# EAGLE design ps_3PS (EAGLE 7.2.0)
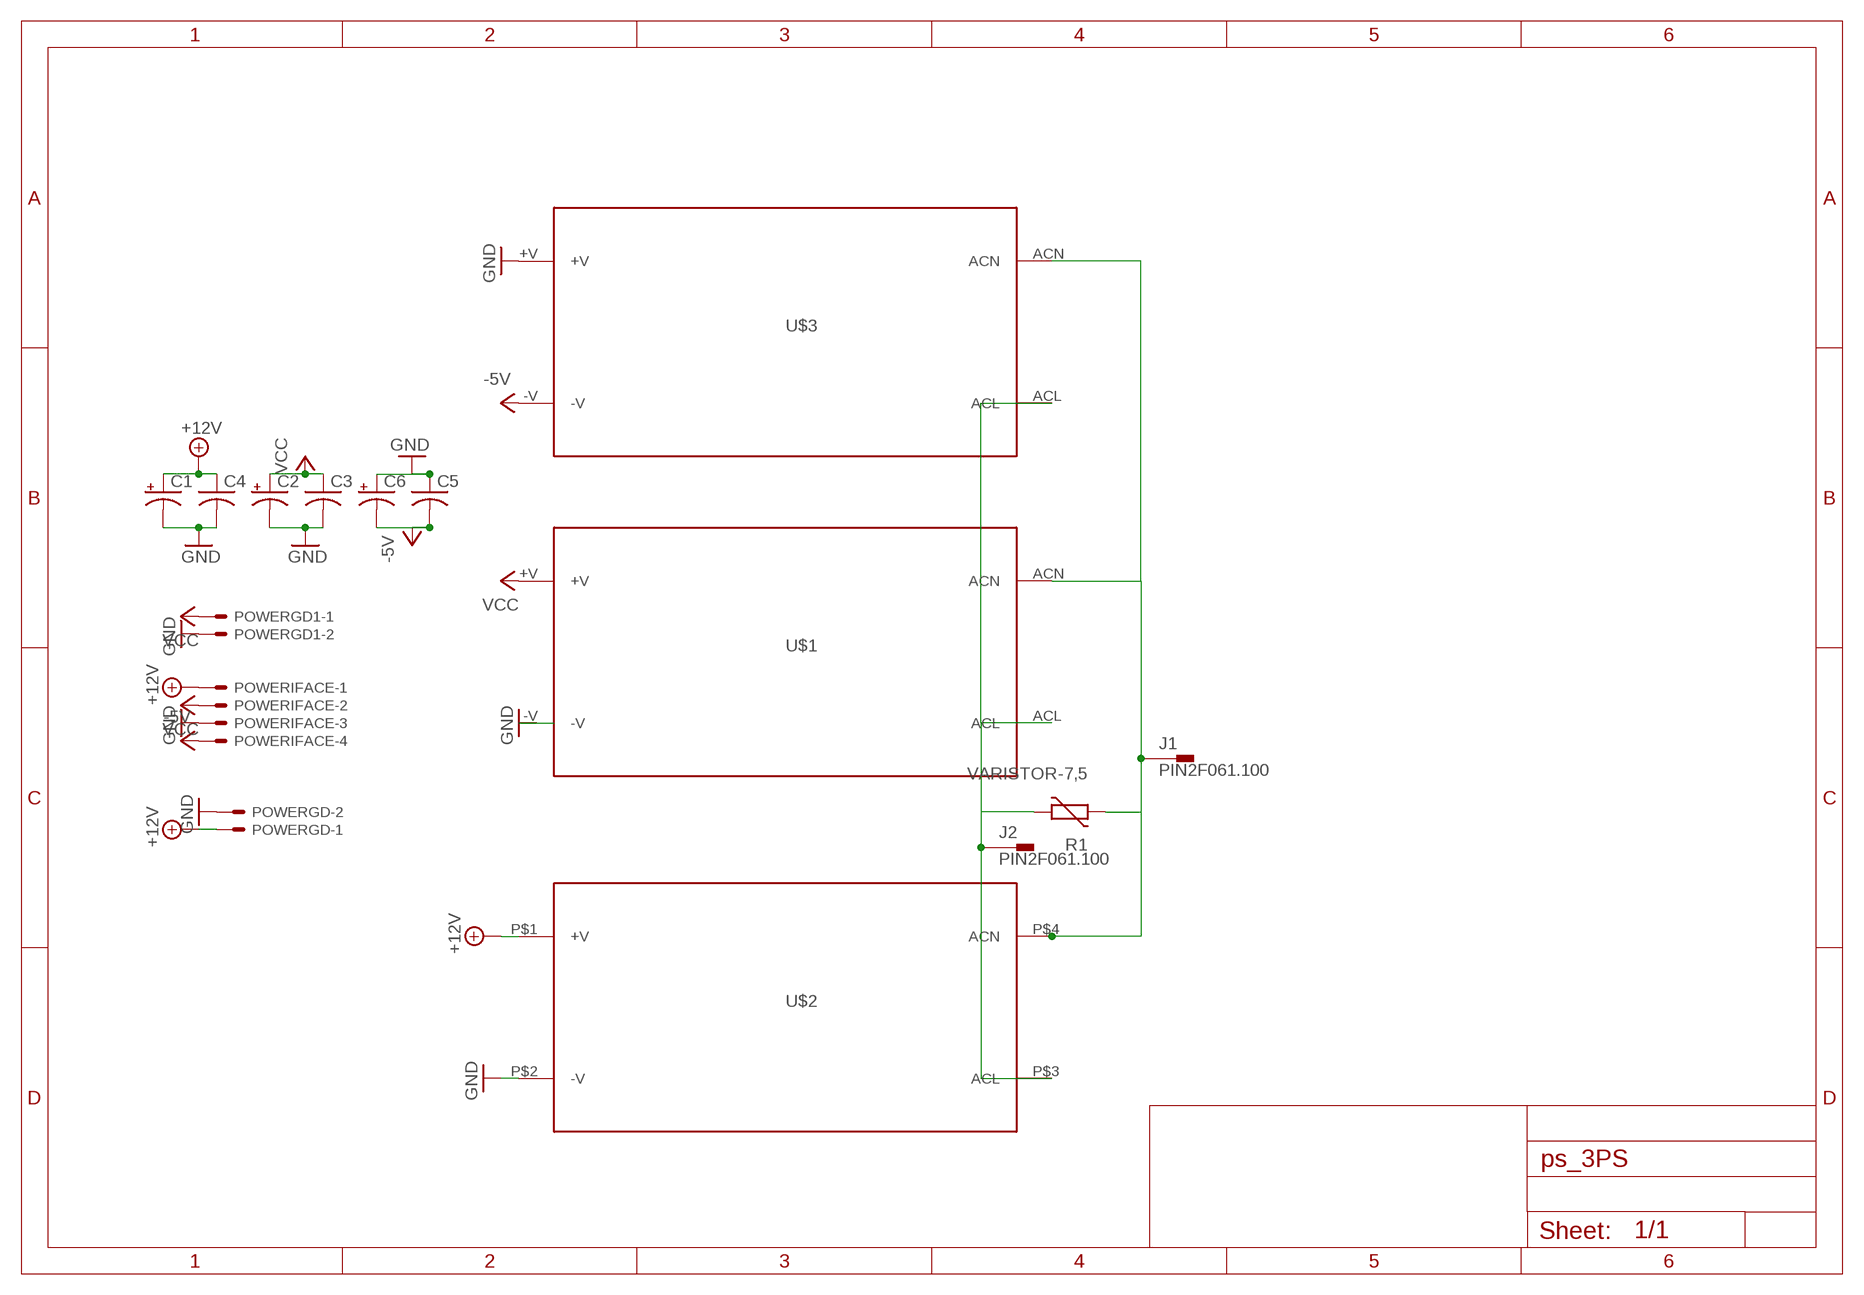
[diagram p0: schematic, sheet 1]

## Parts
C1  CPOL-USE5-13  [E5-13]
C2  CPOL-USE5-13  [E5-13]
C3  C-US050-050X075  [C050-050X075]
C4  C-US050-050X075  [C050-050X075]
C5  C-US050-050X075  [C050-050X075]
C6  CPOL-USE5-13  [E5-13]
J1  PIN2F061.100  [F061.100]
J2  PIN2F061.100  [F061.100]
POWERGD  KK-156-2  [KK-156-2]
POWERGD1  KK-156-2  [KK-156-2]
POWERIFACE  KK-156-4  [KK-156-4]
R1  VARISTOR-7,5  [R-7,5]
U$1  IRM-05-05  [IRM-05-05]
U$2  IRM-60-12  [IRM-60-12]
U$3  IRM-05-05  [IRM-05-05]

## Nets
+12V: C1.+ C4.1 POWERGD.1 POWERIFACE.1 U$2.P$1(+V)
-5V: C5.2 C6.- POWERIFACE.4 U$3.-V
GND: C1.- C2.- C3.2 C4.2 C5.1 C6.+ POWERGD1.2 POWERGD.2 POWERIFACE.3 U$1.-V U$2.P$2(-V) U$3.+V
N$1: J1.A1 J1.A2 R1.2 U$1.ACN U$2.P$4(ACN) U$3.ACN
N$2: J2.A1 J2.A2 R1.1 U$1.ACL U$2.P$3(ACL) U$3.ACL
VCC: C2.+ C3.1 POWERGD1.1 POWERIFACE.2 U$1.+V

## Library data of the parts
C1 C2 C6 = rcl:CPOL-US: POLARIZED CAPACITOR, American symbol
C3-C5 = rcl:C-US: CAPACITOR, American symbol
J1 J2 = con-faston:PIN2: Flachstecker Typ Tyco/Electronics/AMP TAB, FASTON Printed Circuit Board Tabs Source: http://www.buerklin.com, http://catalog.tycoelectronics.com; OC_FARNELL: unknown; OC_NEWARK: unknown
POWERGD POWERGD1 = con-molex:KK-156-2: KK 156 HEADER Source: http://www.molex.com/pdm_docs/sd/026604100_sd.pdf; OC_FARNELL: unknown; OC_NEWARK: unknown
POWERIFACE = con-molex:KK-156-4: KK 156 HEADER Source: http://www.molex.com/pdm_docs/sd/026604100_sd.pdf; OC_FARNELL: unknown; OC_NEWARK: unknown
R1 = varistor:VARISTOR: VARISTOR
U$1 U$3 = meanwell:IRM-05-05
U$2 = meanwell:IRM-60-12

## Board
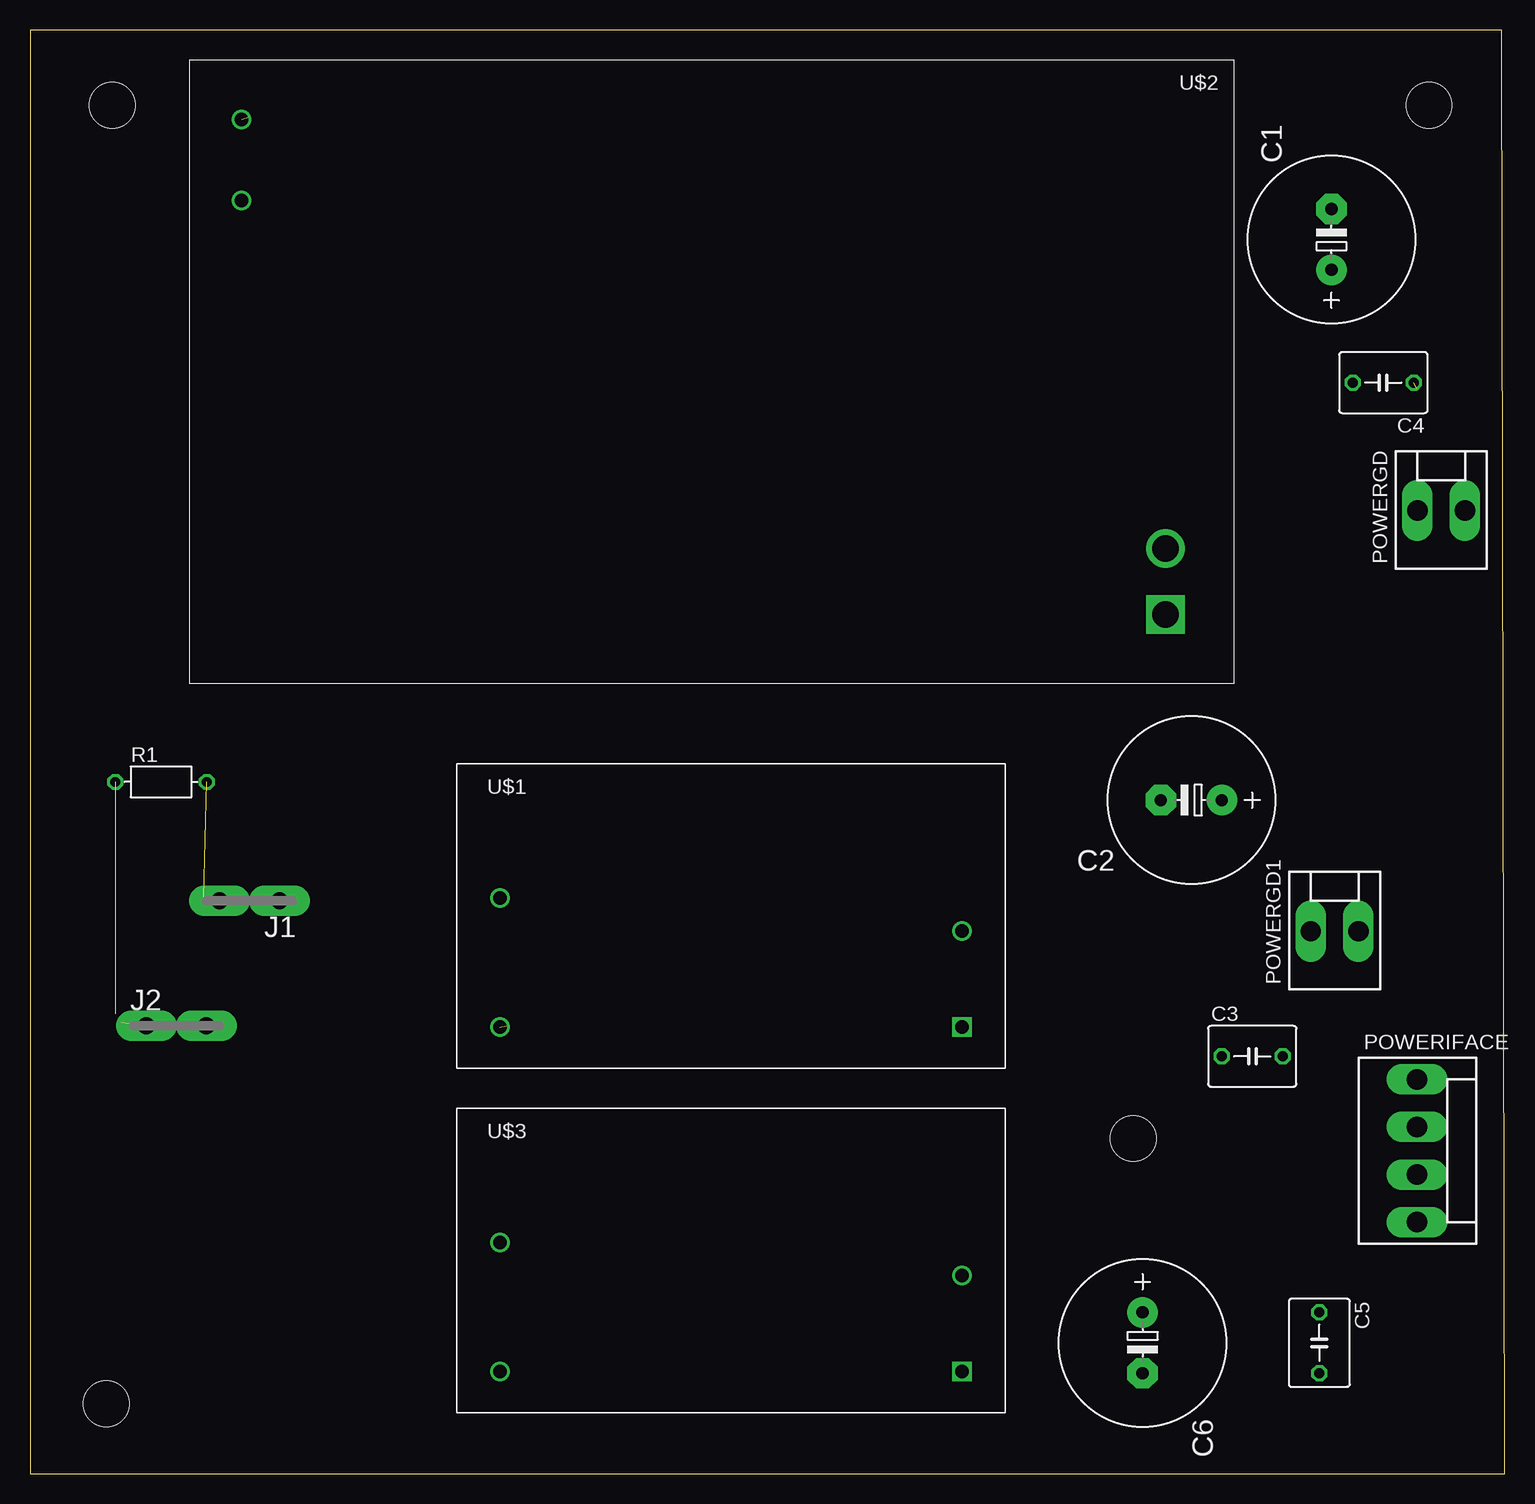
[diagram p1: board, top side]
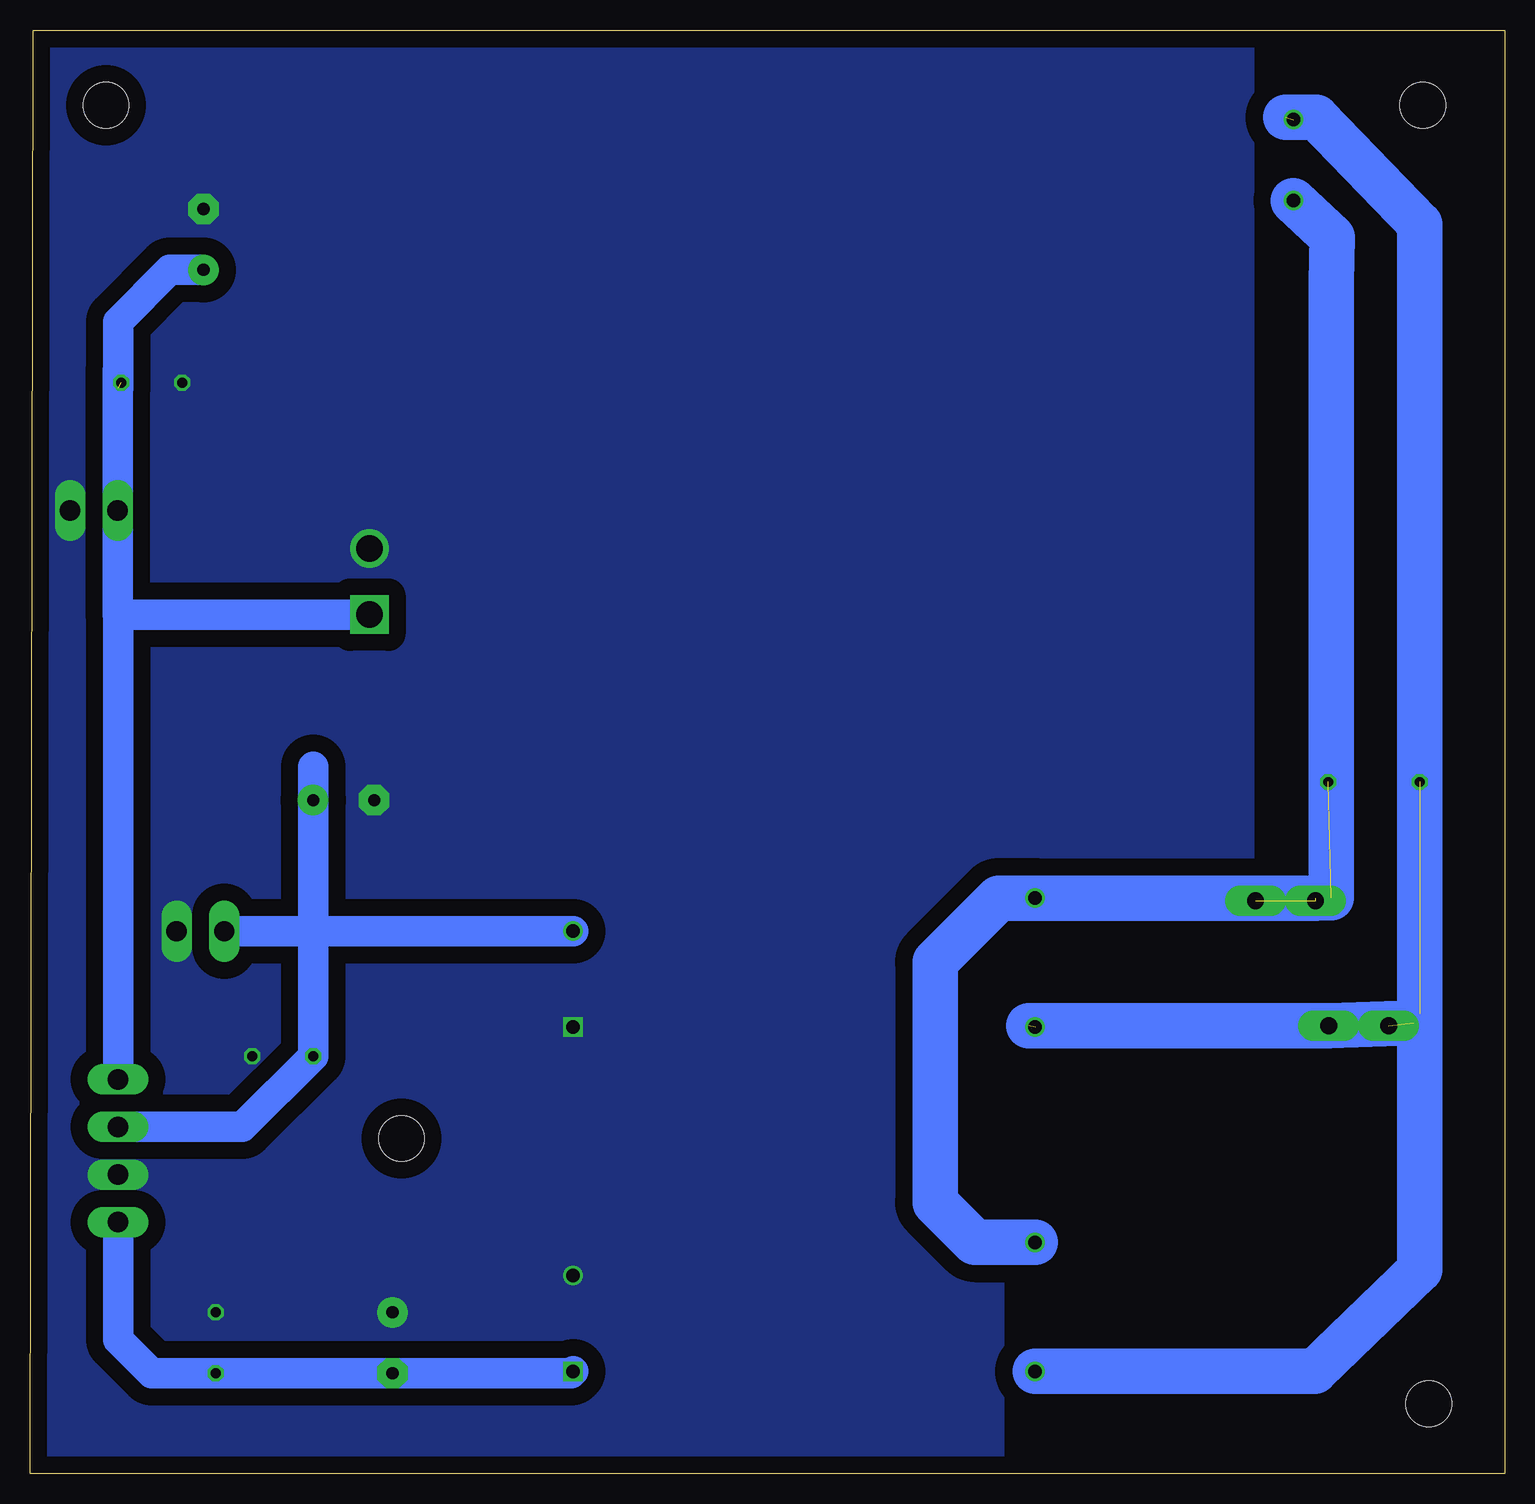
[diagram p2: board, bottom side, seen from below]

Size 122.92 x 120.32 mm. Coordinates in mm from the lower left corner, seen from the top.
Outline: 0,0 122.92,0 122.66,120.32 0,120.32 0,0
Copper layers (1*16): Top 0.035mm / dielectric 1.5mm / Bottom 0.035mm
Design rules "default": minimum track width 10mil, minimum drill 24mil, track to track 8mil, track to pad 8mil, pad to pad 8mil, via to via 8mil, smd to smd 8mil, copper to edge 40mil, drill to drill 8mil, minimum pad ring 10mil, minimum via ring 8mil, stop-mask expansion 4mil, vias tented up to drill 0mil, thermal gap 10mil
Holes 3.8 mm at 116.59,114.05 91.95,27.94 6.86,114.05 6.35,5.84

### Footprints (pad centres in the part's own frame; a part is rotated, then mirrored left to right if it is on the bottom)
E5-13 = drill 1.016 pad 2.54: + -2.54,0 | drill 1.016 pad 2.54 octagon: - 2.54,0
C050-050X075 = drill 0.813 octagon: 1 -2.54,0; 2 2.54,0
F061.100 = drill 1.4 pad 2.54 long: A1 -2.5,0; A2 2.5,0
KK-156-2 = drill 1.7 pad 2.184 long: 1 -1.98,0; 2 1.98,0
KK-156-4 = drill 1.7 pad 2.184 long: 1 -5.94,0; 2 -1.98,0; 3 1.98,0; 4 5.94,0
R-7,5 = drill 0.813 octagon: 1 -3.81,0; 2 3.81,0
IRM-05-05 = drill 1.1: +V 42.1,11.45; ACL 3.6,3.45; ACN 3.6,14.2 | drill 1.1 square: -V 42.1,3.45
IRM-60-12 = drill 2.2 square: P$1 5.7,46.25 | drill 2.2: P$2 5.7,40.75 | drill 1.1: P$3 82.7,5; P$4 82.7,11.75

### Placement (x,y rotation side)
C1  108.46,102.87 90 top
C2  96.77,56.13 180 top
C3  101.85,34.8 0 top
C4  112.78,90.93 180 top
C5  107.44,10.92 270 top
C6  92.71,10.92 270 top
J1  18.29,47.75 180 top
J2  12.19,37.34 0 top
POWERGD  117.6,80.26 0 top
POWERGD1  108.71,45.21 0 top
POWERIFACE  115.57,26.92 270 top
R1  10.92,57.66 0 top
U$1  35.56,33.78 0 top
U$2  100.33,117.86 180 top
U$3  35.56,5.08 0 top

### Tracks (layer width: path | path; a pad name or v marks a point on that pad's centre or on a via)
+12V  (1 unrouted)
  Bottom 2.54: 115.62,90.42 POWERGD.1 115.62,72.14 | 115.62,90.42 115.62,91.95 | C1.+ 111.25,100.33 115.57,96.01 115.57,90.48 115.62,90.42 | U$2.P$1 115.6,71.61 | 115.6,71.61 115.62,72.14 | 115.62,72.14 115.32,71.37 | POWERIFACE.1 115.57,71.58 115.6,71.61
-5V
  Bottom 2.54: POWERIFACE.4 115.57,11.18 112.78,8.38 C5.2 C6.- 77.81,8.38 U$3.-V
GND
  pour Bottom (isolate 1.422, no thermals): 41.91,120.4 122.68,120.14 122.94,0.25 41.91,0.25
N$1  (3 unrouted)
  Bottom 3.81: U$2.P$4 14.41,103.06 14.48,99.31 14.48,48.01 15.77,47.98 U$1.ACN 42.19,47.98 47.5,42.67 47.5,22.61 44.2,19.3 39.18,19.3 U$3.ACN
N$2  (4 unrouted)
  Bottom 3.81: 7.11,38.35 7.11,104.14 15.75,113.03 18.29,113.03 | 7.11,38.35 7.11,37.59 | 7.11,37.59 7.61,37.58 | 7.61,37.58 J2.A2 39.67,37.34 | U$3.ACL 15.85,8.53 7.11,17.02 7.11,37.59 | 7.11,38.35 7.61,37.58
N$3
  pour Bottom (isolate 1.422, no thermals): 21.08,119.89 42.93,119.89 43.18,51.05 21.08,51.31
VCC
  Bottom 2.54: U$1.+V 92.46,45.23 92.2,45.21 99.31,45.21 | 99.31,45.21 C2.+ 99.31,58.93 | 99.31,45.21 C3.1 105.21,28.9 POWERIFACE.2 | POWERGD1.1 99.31,45.21